# EAGLE design RailSlave (EAGLE 6.3)
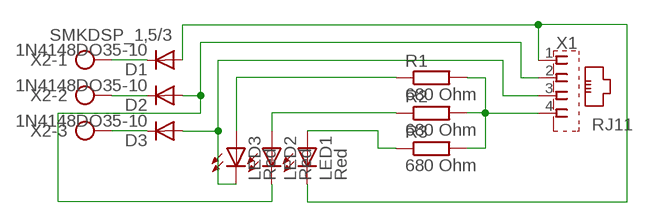
[diagram p0: schematic, sheet 1]

## Parts
D1  1N4148DO35-10  [DO35-10]
D2  1N4148DO35-10  [DO35-10]
D3  1N4148DO35-10  [DO35-10]
LED1  Red  LED3MM  [LED3MM]
LED2  Red  LED3MM  [LED3MM]
LED3  Red  LED3MM  [LED3MM]
R1  680 Ohm  R-EU_0207/10  [0207/10]
R2  680 Ohm  R-EU_0207/10  [0207/10]
R3  680 Ohm  R-EU_0207/10  [0207/10]
X1  RJ11  RJ11-6PC4  [RJ116PC4]
X2  SMKDSP_1,5/3  [SMKDSP_1,5/3]

## Nets
N$1: D2.C X2.2
N$2: D1.C X2.1
N$3: D3.C X2.3
N$4: D1.A LED1.K(C) X1.1
N$5: D2.A LED2.K(C) X1.2
N$6: R1.2 R2.2 R3.2 X1.4
N$7: LED3.A R1.1
N$8: LED2.A R2.1
N$9: D3.A LED3.K(C) X1.3
N$10: LED1.A R3.1

## Library data of the parts
D1-D3 = diode:1N4148: DIODE high speed (Philips)
LED1-LED3 = led:LED: LED OSRAM: - CHIPLED LG R971, LG N971, LY N971, LG Q971, LY Q971, LO R971, LY R971 LH N974, LH R974 LS Q976, LO Q976, LY Q976 LO Q996 - Hyper CHIPLED LW Q18S LB Q993, LB Q99A, LB R99A - SideLED LS A670, LO A670, LY A670, LG A670, LP A670 LB A673, LV A673, LT A673, LW A673 LH A674 LY A675 LS A676, LA A676, LO A676, LY A676, LW A676 LS A679, LY A679, LG A679 - Hyper Micro SIDELED® LS Y876, LA Y876, LO Y876, LY Y876 LT Y87S - SmartLED LW L88C, LW L88S LB L89C, LB L89S, LG L890 LS L89K, LO L89K, LY L89K LS L896, LA L896, LO L896, LY L896 - TOPLED LS T670, LO T670, LY T670, LG T670, LP T670 LSG T670, LSP T670, LSY T670, LOP T670, LYG T670 LG T671, LOG T671, LSG T671 LB T673, LV T673, LT T673, LW T673 LH T674 LS T676, LA T676, LO T676, LY T676, LB T676, LH T676, LSB T676, LW T676 LB T67C, LV T67C, LT T67C, LS T67K, LO T67K, LY T67K, LW E67C LS E67B, LA E67B, LO E67B, LY E67B, LB E67C, LV E67C, LT E67C LW T67C LS T679, LY T679, LG T679 LS T770, LO T770, LY T770, LG T770, LP T770 LB T773, LV T773, LT T773, LW T773 LH T774 LS E675, LA E675, LY E675, LS T675 LS T776, LA T776, LO T776, LY T776, LB T776 LHGB T686 LT T68C, LB T68C - Hyper Mini TOPLED® LB M676 - Mini TOPLED Santana® LG M470 LS M47K, LO M47K, LY M47K Source: http://www.osram.convergy.de LUXEON: - LUMILED® LXK2-PW12-R00, LXK2-PW12-S00, LXK2-PW14-U00, LXK2-PW14-V00 LXK2-PM12-R00, LXK2-PM12-S00, LXK2-PM14-U00 LXK2-PE12-Q00, LXK2-PE12-R00, LXK2-PE12-S00, LXK2-PE14-T00, LXK2-PE14-U00 LXK2-PB12-K00, LXK2-PB12-L00, LXK2-PB12-M00, LXK2-PB14-N00, LXK2-PB14-P00, LXK2-PB14-Q00 LXK2-PR12-L00, LXK2-PR12-M00, LXK2-PR14-Q00, LXK2-PR14-R00 LXK2-PD12-Q00, LXK2-PD12-R00, LXK2-PD12-S00 LXK2-PH12-R00, LXK2-PH12-S00 LXK2-PL12-P00, LXK2-PL12-Q00, LXK2-PL12-R00 Source: www.luxeon.com KINGBRIGHT: KA-3528ASYC Source: www.kingbright.com
R1-R3 = resistor:R-EU_: RESISTOR, European symbol
X1 = RailLibrary:RJ11-6PC4
X2 = con-phoenix-smkdsp:SMKDSP_1,5/3: Printklemme, Nennstrom: 17,5 A, Bemessungsspannung: 250 V, Raster: 5,0 mm Source: http://eshop.phoenixcontact.de .. 1733415.pdf; MF: FARNELL; MPN: 1733583; OC_FARNELL: 3041256; OC_NEWARK: 71C4130

## Board
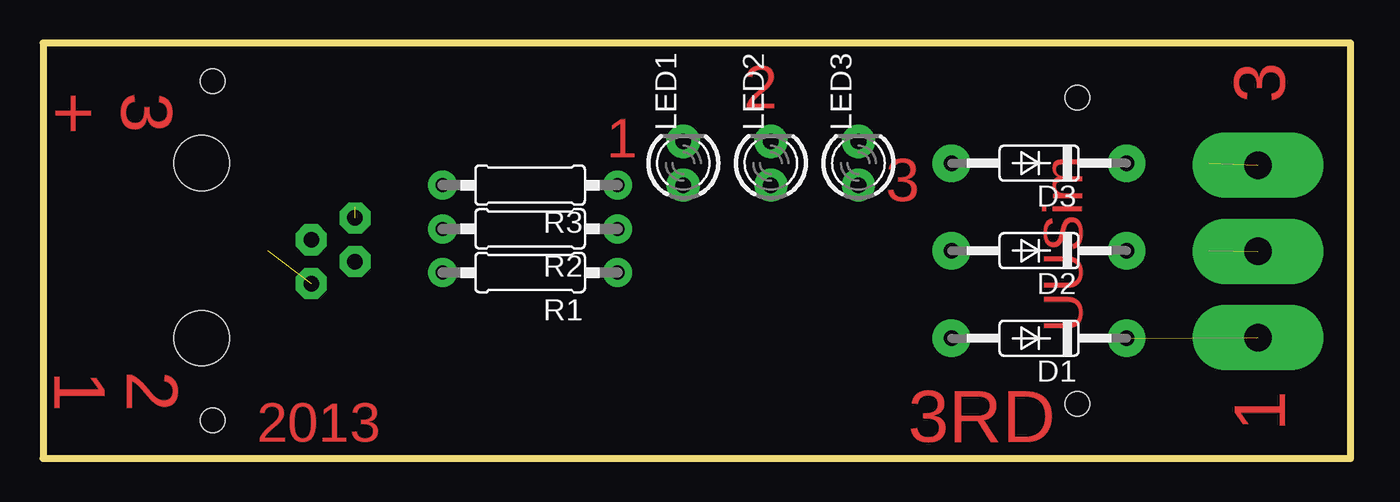
[diagram p1: board, top side]
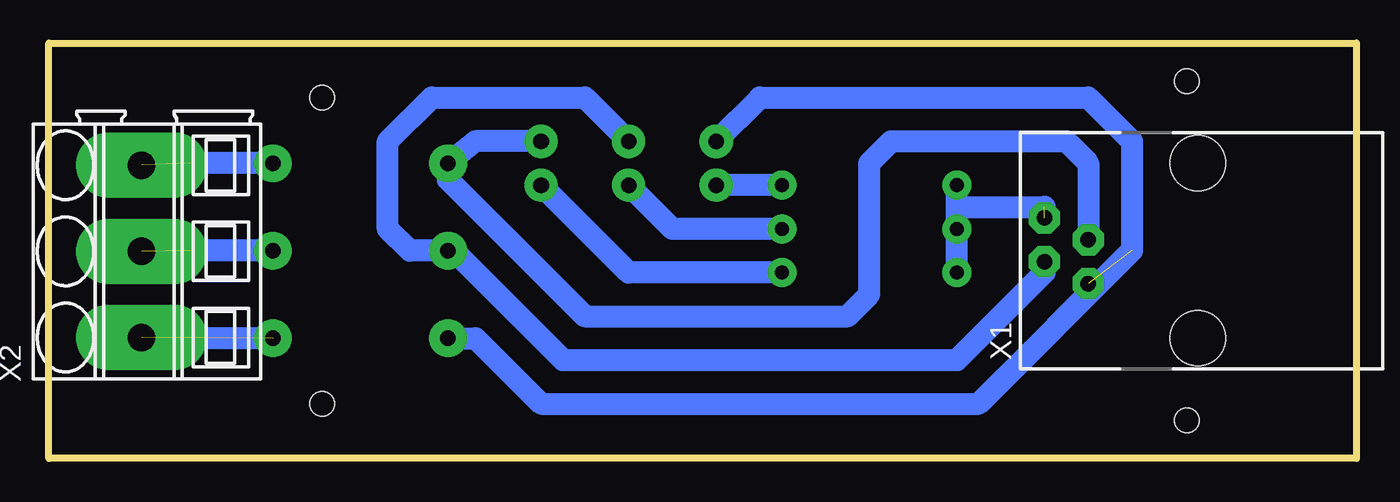
[diagram p2: board, bottom side, seen from below]

Size 75.87 x 24.12 mm. Coordinates in mm from the lower left corner, seen from the top.
Outline: 0,0 75.87,0 75.87,24.12 0,24.12 0,0
Copper layers (1*16): Top 0.035mm / dielectric 1.5mm / Bottom 0.035mm
Design rules "default *": minimum track width 5mil, minimum drill 24mil, track to track 8mil, track to pad 8mil, pad to pad 8mil, via to via 8mil, smd to smd 8mil, copper to edge 40mil, drill to drill 8mil, minimum pad ring 10mil, minimum via ring 8mil, stop-mask expansion 4mil, vias tented up to drill 0mil, thermal gap 10mil
Holes 1.4 mm at 9.84,21.91 60.01,20.95 60.01,3.17 9.84,2.22

### Footprints (pad centres in the part's own frame; a part is rotated, then mirrored left to right if it is on the bottom)
DO35-10 = drill 0.9 pad 2.184: A 5.08,0; C -5.08,0
LED3MM = drill 0.9 pad 1.93: A -1.27,0; K 1.27,0
0207/10 = drill 0.813 pad 1.676: 1 -5.08,0; 2 5.08,0
RJ116PC4 = drill 0.9 pad 1.803 octagon: 1 -1.905,5.08; 2 -0.635,7.62; 3 0.635,5.08; 4 1.905,7.62 | hole 3.2: -5.08,-1.27; 5.08,-1.27
SMKDSP_1,5/3 = drill 1.6 pad 3.81 long: 1 -2.5,0; 2 2.5,0; 3 7.5,0

### Placement (x,y rotation side)
D1  57.78,6.98 180 top
D2  57.78,12.06 180 top
D3  57.78,17.14 180 top
LED1  37.15,17.14 90 top
LED2  42.23,17.14 90 top
LED3  47.31,17.14 90 top
R1  28.26,10.8 180 top
R2  28.26,13.33 180 top
R3  28.26,15.88 180 top
X1  10.48,12.06 90 bottom
X2  70.48,9.53 90 bottom

### Tracks (layer width: path | path; a pad name or v marks a point on that pad's centre or on a via)
N$1  (1 unrouted)
  Bottom 1.27: D2.C 67.63,12.06
N$2  (1 unrouted)
N$2BLUE
  Bottom 1.27: 62.87,6.98 65.09,6.98 67.63,6.98
N$3  (1 unrouted)
  Bottom 1.27: D3.C 67.63,17.14
N$4  (1 unrouted)
  Bottom 1.27: LED1.K 34.61,20.95 15.56,20.95 13.02,18.42 13.02,12.06 21.91,3.17 47.31,3.17 51.12,6.98 D1.A
N$5
  Bottom 1.016: D2.A 52.39,12.06 | 18.1,10.8 X1.2
  Bottom 1.27: 52.39,12.06 46.04,5.71 23.18,5.71 18.1,10.8 | D2.A 54.93,12.06 56.2,13.33 56.2,18.42 53.66,20.95 44.77,20.95 LED2.K
N$6  (1 unrouted)
  Bottom 0.813: R2.2 23.18,14.61
  Bottom 1.27: R1.2 R2.2 R3.2 | 23.18,14.61 18.1,14.61
N$7
  Bottom 1.27: R1.1 42.23,10.8 LED3.A
N$8
  Bottom 1.27: R2.1 39.69,13.33 LED2.A
N$9
  Bottom 1.27: LED3.K 51.12,18.42 D3.A 52.7,16.19 44.77,8.25 29.53,8.25 28.26,9.53 28.26,17.14 26.99,18.42 16.83,18.42 15.56,17.14 X1.3
N$10
  Bottom 1.27: R3.1 LED1.A

### Text on the board
Top: 3 / + | 2 | 3 | 1 | 3 | UUSim | 2 / 1 | 1 | 2013 | 3RD